# Altium schematic sheet [2] MCU.SchDoc
size A4; DocumentNumber: 3; SheetNumber: 3; SheetTotal: 4
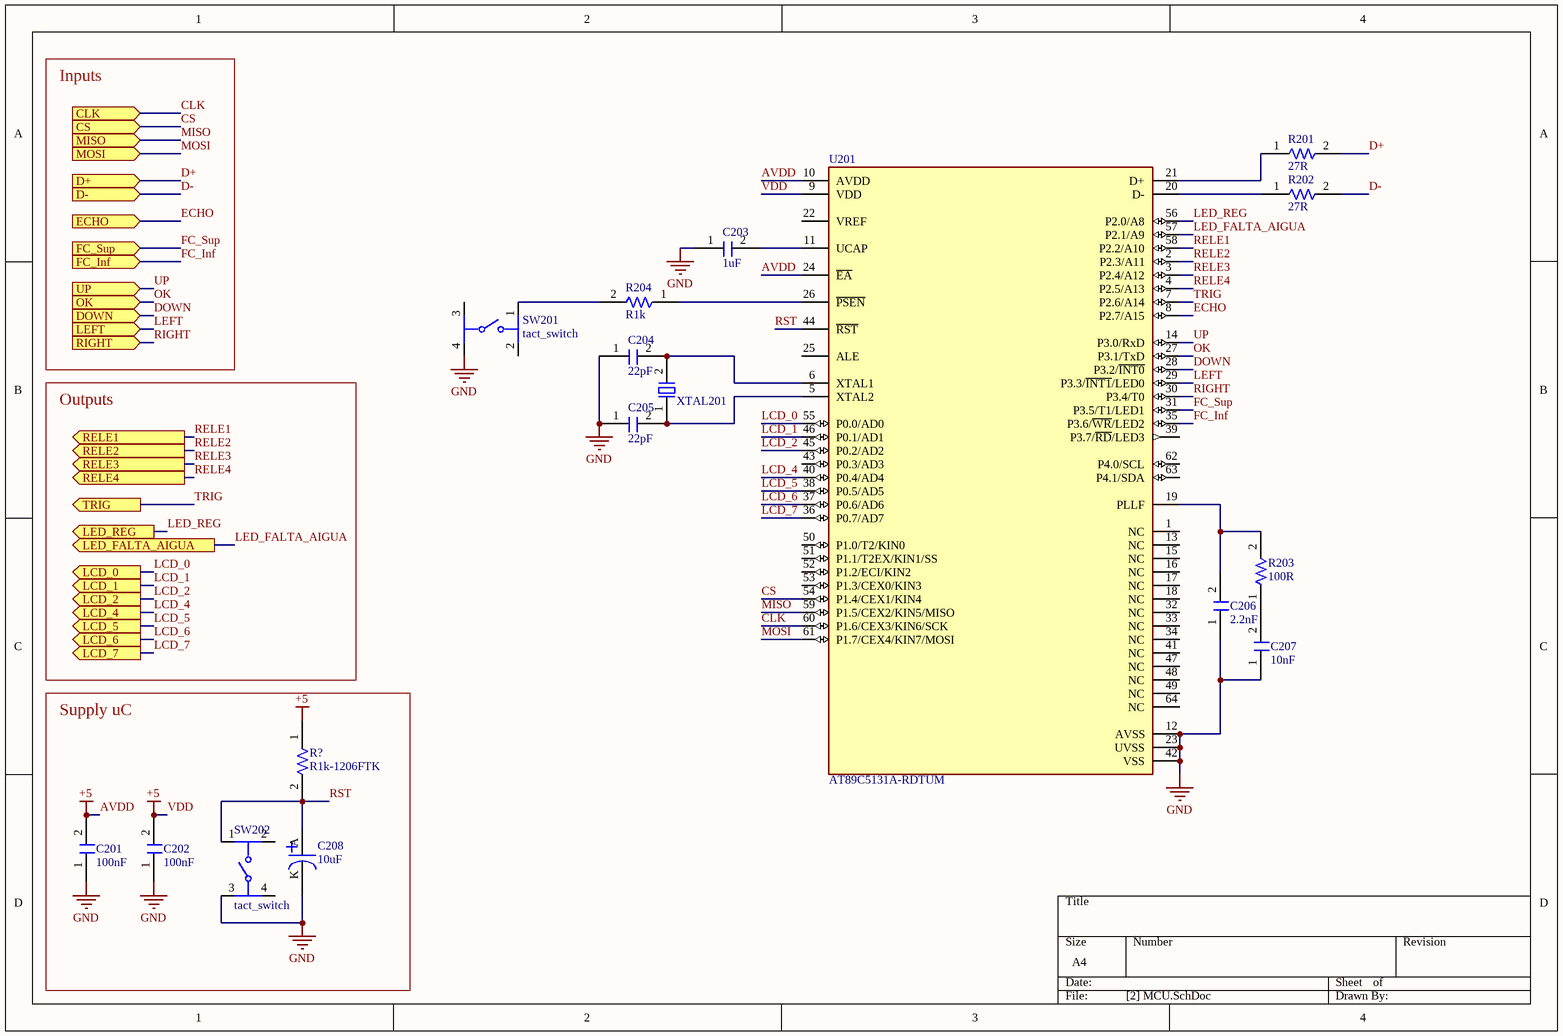
[diagram p0: [2] MCU.SchDoc]

## Parts
C201  Capacitance: 100nF  [C1206FNPC-RW]  (hidden comment: 885012208058)
C202  Capacitance: 100nF  [C1206FNPC-RW]  (hidden comment: 885012208058)
C203  Capacitance: 1uF  [C1206FNPC-RW]  (hidden comment: 885012208013)
C204  Capacitance: 22pF  [C0805FNPC-W]  (hidden comment: 885012208058)
C205  Capacitance: 22pF  [C0805FNPC-W]  (hidden comment: 885012208058)
C206  Capacitance: 2.2nF  [C2.2u-100V-1812MLCC-X7R]  (hidden comment: HMK432B7225KM-T)
C207  Capacitance: 10nF  [C0805FNPC-R]  (hidden comment: 885012207092)
C208  10uF  [C100u-100V-0.9A]
R201  Resistance: 27R  [R1206FTK-W]  (hidden comment: RCC1206470RFKEA)
R202  Resistance: 27R  [R1206FTK-W]  (hidden comment: RCC1206470RFKEA)
R203  Resistance: 100R  [R1206FTK-W]  (hidden comment: CRG1206F100R)
R204  R1k  [R1206FTK-W]
R?  R1k-1206FTK  [R1206FTK-W]
SW201  tact_switch  [FP-PTS647SK38SMTR2LFS-MFG]
SW202  tact_switch  [FP-PTS647SK38SMTR2LFS-MFG]
U201  AT89C5131A-RDTUM  [FP-AT89C5131A-RDTUM-IPC_C]
XTAL201  XTAL20M_SMD  [XTAL20M_SMD]  (value not drawn)

## Blocks framed on the sheet
Supply uC: C201 C202 C208 R? SW202

## Ports
CLK (in, see AD_info[2B], [3] ADC[1A]), CS (in, see AD_info[2B], [3] ADC[1A]), D+ (in, see AD_info[2B]), D- (in, see AD_info[2B]), DOWN (in, see AD_info[2C], [4] Ports[1B]), ECHO (in, see AD_info[2B]), FC_Inf (in, see AD_info[2B]), FC_Sup (in, see AD_info[2B]), LCD_0 (out, see AD_info[2B], [4] Ports[1A]), LCD_1 (out, see AD_info[2C], [4] Ports[1A]), LCD_2 (out, see AD_info[2C], [4] Ports[1B]), LCD_4 (out, see AD_info[2C], [4] Ports[1B]), LCD_5 (out, see AD_info[2C], [4] Ports[1B]), LCD_6 (out, see AD_info[2C], [4] Ports[1B]), LCD_7 (out, see AD_info[2C], [4] Ports[1B]), LED_FALTA_AIGUA (out, see AD_info[2B], [4] Ports[1A]), LED_REG (out, see AD_info[2B], [4] Ports[1A]), LEFT (in, see AD_info[2C], [4] Ports[1B]), MISO (in, see AD_info[2B], [3] ADC[1A]), MOSI (in, see AD_info[2B], [3] ADC[1B]), OK (in, see AD_info[2C], [4] Ports[1B]), RELE1 (out, see AD_info[2B], [4] Ports[1A]), RELE2 (out, see AD_info[2B]), RELE3 (out, see AD_info[2B]), RELE4 (out, see AD_info[2B]), RIGHT (in, see AD_info[2C], [4] Ports[1B]), TRIG (out, see AD_info[2B]), UP (in, see AD_info[2B], [4] Ports[1B])

## Nets
AVDD: C201.2 C202.2 R?.1 U201.9(VDD) U201.10(AVDD) U201.24(~{EA})  [also labelled +5, VDD]
GND: C201.1 C202.1 C203.1 C204.1 C205.1 C206.1 C207.1 C208.K(-) SW201.4 SW202.3 U201.12(AVSS) U201.23(UVSS) U201.42(VSS)
CLK: U201.60(P1.6/CEX3/KIN6/SCK) ; port CLK
CS: U201.54(P1.4/CEX1/KIN4) ; port CS
D+: R201.2 ; port D+
D-: R202.2 ; port D-
DOWN: U201.28(P3.2/~{INT0}) ; port DOWN
ECHO: U201.8(P2.7/A15) ; port ECHO
FC_Inf: U201.35(P3.6/~{WR}/LED2) ; port FC_Inf
FC_Sup: U201.31(P3.5/T1/LED1) ; port FC_Sup
LCD_0: U201.55(P0.0/AD0) ; port LCD_0
LCD_1: U201.46(P0.1/AD1) ; port LCD_1
LCD_2: U201.45(P0.2/AD2) ; port LCD_2
LCD_4: U201.40(P0.4/AD4) ; port LCD_4
LCD_5: U201.38(P0.5/AD5) ; port LCD_5
LCD_6: U201.37(P0.6/AD6) ; port LCD_6
LCD_7: U201.36(P0.7/AD7) ; port LCD_7
LED_FALTA_AIGUA: U201.57(P2.1/A9) ; port LED_FALTA_AIGUA
LED_REG: U201.56(P2.0/A8) ; port LED_REG
LEFT: U201.29(P3.3/~{INT1}/LED0) ; port LEFT
MISO: U201.59(P1.5/CEX2/KIN5/MISO) ; port MISO
MOSI: U201.61(P1.7/CEX4/KIN7/MOSI) ; port MOSI
OK: U201.27(P3.1/TxD) ; port OK
RELE1: U201.58(P2.2/A10) ; port RELE1
RELE2: U201.2(P2.3/A11) ; port RELE2
RELE3: U201.3(P2.4/A12) ; port RELE3
RELE4: U201.4(P2.5/A13) ; port RELE4
RIGHT: U201.30(P3.4/T0) ; port RIGHT
RST: C208.A(+) R?.2 SW202.1 U201.44(~{RST})
TRIG: U201.7(P2.6/A14) ; port TRIG
UP: U201.14(P3.0/RxD) ; port UP
NetC203_2: C203.2 U201.11(UCAP)
NetC204_2: C204.2 U201.6(XTAL1) XTAL201.2
NetC205_2: C205.2 U201.5(XTAL2) XTAL201.1
NetC206_2: C206.2 R203.2 U201.19(PLLF)
NetC207_2: C207.2 R203.1
NetR201_1: R201.1 U201.21(D+)
NetR202_1: R202.1 U201.20(D-)
NetR204_1: R204.1 U201.26(~{PSEN})
NetR204_2: R204.2 SW201.1

Not connected (* = marked no-connect by the designer): SW201 2 3; SW202 2 4; U201 1(NC) 13(NC) 15(NC) 16(NC) 17(NC) 18(NC) 22(VREF) 25(ALE) 32(NC) 33(NC) 34(NC) 39(P3.7/~{RD}/LED3) 41(NC) 43(P0.3/AD3) 47(NC) 48(NC) 49(NC) 50(P1.0/T2/KIN0) 51(P1.1/T2EX/KIN1/SS) 52(P1.2/ECI/KIN2) 53(P1.3/CEX0/KIN3) 62(P4.0/SCL) 63(P4.1/SDA) 64(NC)

## Notes on the sheet
- Inputs
- Outputs

## Library data of the parts
C201 C202 = C100n-25V-1206FNPC-X7R: Cap Cer 0.1UF 25V X7R 1206; Manufacturer: Wurth Electronics; Tolerance: 10%; .Creator: DO; Category: Capacitor; ComponentLink1Description: Datasheet; ComponentLink1URL: https://www.we-online.com/catalog/datasheet/885012208058.pdf; ComponentLink2Description: Where buy it; ComponentLink2URL: https://www.we-online.com/catalog/en/WCAP-CSGP-25VDC#885012208058; Supplier 1: Digi-Key; Manufacturer Part Number: 885012208058; RoHS: Yes; Stock 1: 4375; Pricing 1: 1=0,11000, 10=0,10100, 100=0,09100, 500=0,08000 (USD); Mount: Surface Mount; Case/Package: 1206; Case Code (Metric): 3216; Case Code (Imperial): 1206; Min Operating Temperature: -55°C; Max Operating Temperature: 125°C; Packaging: Tape and Reel; Voltage Rating: 25V; Length: 0.126inch; Width: 0.063inch; Thickness: 0.035inch; RoHS Compliant: Yes; ComponentLink3URL: https://katalog.we-online.de/pbs/datasheet/885012208058.pdf?src-supplier=Digi-Key; ComponentLink3Description: https://katalog.we-online.de/pbs/datasheet/885012208058.pdf?src-supplier=Digi-Key; Supplier Part Number 1: 732-8109-1-ND
C203 = C1u-10V-1206FNPC-X7R: Cap, Mlcc, X7R, 1Uf, 10V, 1206 Rohs Compliant: Yes; Manufacturer 1: Wurth Electronics; Tolerance: 10%; .Creator: GP; Supplier 1: Digi-Key; Manufacturer Part Number 1: 885012208013; RoHS: Yes; Category: Ceramic Capacitors; Stock 1: 2734; Pricing 1: 1=0,16000, 10=0,14900, 100=0,13300, 500=0,11800 (USD); Mount: Surface Mount; Case/Package: 1206; Case Code (Metric): 3216; Case Code (Imperial): 1206; Min Operating Temperature: -55°C; Max Operating Temperature: 125°C; Packaging: Tape and Reel; Voltage Rating: 10V; Length: 0.126inch; Width: 0.063inch; Thickness: 0.051inch; RoHS Compliant: Yes; ComponentLink1URL: https://katalog.we-online.de/pbs/datasheet/885012208013.pdf?src-supplier=Digi-Key; ComponentLink1Description: https://katalog.we-online.de/pbs/datasheet/885012208013.pdf?src-supplier=Digi-Key; Supplier Part Number 1: 732-7685-1-ND; ComponentLink2Description: Wurth Elektronik; ComponentLink2URL: https://www.we-online.com/catalog/en/WCAP-CSGP-10VDC?sq=885012208013#885012208013
C204 C205 = C0.22u-0805FNPC-X5R: Cap Ceramic 0.22uF 50V X5R 10% Pad SMD 0805 85C Low ESR Automotive T/R; Manufacturer: Taiyo Yuden; Manufacturer Part Number: UMK212BJ224KGHT; .Creator: DR; Category: Capacitor; ComponentLink1Description: Datasheet; ComponentLink1URL: https://eu.mouser.com/datasheet/2/396/taiyo_yuden_12132018_mlcc11_hq_e-1510082.pdf; ComponentLink2Description: Where buy it; ComponentLink2URL: https://eu.mouser.com/ProductDetail/Taiyo-Yuden/UMK212BJ224KGHT?qs=CNQs48zzdnpf%2FbZJTfp33Q%3D%3D; Supplier 1: Digi-Key; RoHS: Yes; Stock 1: 900; Pricing 1: 1=0,20000, 10=0,13700, 50=0,08220, 100=0,06950, 500=0,04754, 1000=0,04206 (USD); Mount: Surface Mount; Case/Package: 0805; Case Code (Metric): 2012; Case Code (Imperial): 0805; Min Operating Temperature: -55°C; Max Operating Temperature: 85°C; Package Quantity: 3000; Packaging: Tape and Reel; Tolerance: 10%; Voltage Rating: 50V; Voltage Rating (DC): 50V; Dielectric: X5R; Termination: SMD/SMT; Length: 0.079inch; Width: 0.049inch; Height: 1.25mm; Thickness: 0.053inch; Ratings: AEC-Q200; Lead Free: Lead Free; Halogen Free: Halogen Free; RoHS Compliant: Yes; Supplier Part Number 1: 587-3514-1-ND
C206 = C2.2u-100V-1812MLCC-X7R: 贴片陶瓷电容 2.2uF ±10% 100V X7R 1812; Manufacturer: Taiyo Yuden; .Creator: DO; Manufacturer Part Number: HMK432B7225KM-T; RoHS: Yes; Category: Ceramic Capacitors; Stock 1: 13000; Pricing 1: 500=0,58000, 1000=0,47500, 1500=0,47000, 2000=0,46500 (USD); Mount: Surface Mount; Case/Package: 1812; Number of Pins: 2; Case Code (Metric): 4532; Case Code (Imperial): 1812; Min Operating Temperature: -55°C; Max Operating Temperature: 125°C; Package Quantity: 1; Voltage Rating: 100V; Tolerance: 10%; Packaging: Tape and Reel; Voltage Rating (DC): 100V; Dielectric: X7R; Termination: SMD/SMT; Series: M; Construction: Flat; Resistor Type: Ceramic; Length: 4.5mm; Width: 0.126inch; Height: 2.5mm; Thickness: 0.106inch; Depth: 3.2mm; Radiation Hardening: No; RoHS Compliant: Yes; REACH SVHC: Unknown; Halogen Free: Halogen Free; ComponentLink1URL: https://datasheet.ciiva.com/142/hmk432b7225km-t-ss-142288.pdf?src-supplier=Digi-Key; ComponentLink1Description: https://datasheet.ciiva.com/142/hmk432b7225km-t-ss-142288.pdf?src-supplier=Digi-Key; ComponentLink2URL: https://datasheet.ciiva.com/26871/getdatasheetpartid-638888-26871989.pdf?src-supplier=Verical; ComponentLink2Description: https://datasheet.ciiva.com/26871/getdatasheetpartid-638888-26871989.pdf?src-supplier=Verical; ComponentLink3URL: https://datasheet.ciiva.com/30247/946hmk432b7225km-t-30247370.pdf?src-supplier=Onlinecomponents.com; ComponentLink3Description: https://datasheet.ciiva.com/30247/946hmk432b7225km-t-30247370.pdf?src-supplier=Onlinecomponents.com; ComponentLink4URL: https://datasheet.ciiva.com/28645/746258-28645086.pdf?src-supplier=Element14; ComponentLink4Description: https://datasheet.ciiva.com/28645/746258-28645086.pdf?src-supplier=Element14; ComponentLink5URL: https://datasheet.ciiva.com/15921/mlcc06-e-15921031.pdf?src-supplier=Onlinecomponents.com; ComponentLink5Description: https://datasheet.ciiva.com/15921/mlcc06-e-15921031.pdf?src-supplier=Onlinecomponents.com; Supplier Part Number 1: 9062137; Supplier 1: Future Electronics
C207 = C10n-50V-0805FNPC-X7R: Cap, 0.01ΜF, 50V, 10%, X7R, 0805; Manufacturer 1: Wurth Electronics; .Creator: DR; Supplier 1: RSComponents; Manufacturer Part Number 1: 885012207092; RoHS: Yes; Category: Ceramic Capacitors; Stock 1: 1; Pricing 1: 4000=0,03200, 12000=0,03100 (USD); Mount: Surface Mount; Case/Package: 0805; Case Code (Metric): 2012; Case Code (Imperial): 0805; Min Operating Temperature: -55°C; Max Operating Temperature: 125°C; Packaging: Cut Tape; Voltage Rating: 50V; Dielectric: X7R; Tolerance: 10%; Voltage Rating (DC): 50V; Length: 0.079inch; Width: 0.049inch; Thickness: 0.035inch; REACH SVHC: Unknown; RoHS Compliant: Yes; ComponentLink1URL: http://www.farnell.com/datasheets/1958497.pdf?src-supplier=Farnell; ComponentLink1Description: http://www.farnell.com/datasheets/1958497.pdf?src-supplier=Farnell; ComponentLink2URL: http://www.farnell.com/datasheets/1958497.pdf?src-supplier=Element14; ComponentLink2Description: http://www.farnell.com/datasheets/1958497.pdf?src-supplier=Element14; ComponentLink3URL: http://www.farnell.com/datasheets/1958497.pdf?src-supplier=Newark; ComponentLink3Description: http://www.farnell.com/datasheets/1958497.pdf?src-supplier=Newark; ComponentLink4URL: https://katalog.we-online.de/pbs/datasheet/885012207092.pdf?src-supplier=Digi-Key; ComponentLink4Description: https://katalog.we-online.de/pbs/datasheet/885012207092.pdf?src-supplier=Digi-Key; Supplier Part Number 1: 1813941
C208 = CMP-00044-1: Cap 100 Uf 20% 100 V; Manufacturer: Wurth Electronics; Manufacturer Part Number: 860130878011; Voltage Rating: 100V; Value: 100µF; Ripple Current: 270mA; Polarity: Polar; .Creator: GP; Life (Hours): 2000Hour; Lead Pitch: 0.197inch; Package Quantity: 300; Tolerance: 20%; Case/Package: Radial; Source: Passives.SchLib; ComponentLink1Description: http://katalog.we-online.de/pbs/datasheet/860130878011.pdf?src-supplier=Digi-Key; Max Operating Temperature: 125°C; Min Operating Temperature: -40°C; Pricing 1: 2=1,84300, 20=1,71500, 50=1,54700, 100=1,43900, 200=1,27100 (USD); Mount: Through Hole; Stock 1: 1; Packaging: Tape and Reel; ComponentLink1URL: http://katalog.we-online.de/pbs/datasheet/860130878011.pdf?src-supplier=Digi-Key; RoHS: Yes; Design Item ID: C100u-100V-0.9A; Height - Seated (Max): 1.043inch; RoHS Compliant: Yes; Category: Aluminum Electrolytic Capacitors
R201 R202 = R470-1206FTK: Res Thick Film 1206 470 Ohm 1% 1/2W ±100ppm/°C Molded SMD; Manufacturer: Vishay Dale; .Creator: AC; Supplier 1: Newark; RoHS: Yes; Stock 1: 3700; Pricing 1: 10=0,22000, 25=0,17500, 50=0,13000, 100=0,08600, 250=0,06900, 500=0,05200, 1000=0,03500 (USD); Supplier Part Number 1: 45AJ7205; Manufacturer Part Number: RCC1206470RFKEA; ComponentLink1Description: Where buy it; ComponentLink1URL: https://www.mouser.es/ProductDetail/Vishay-Dale/RCC1206470RFKEA?qs=sGAEpiMZZMvdGkrng054twq3eZrCFN897p18zMH0sI9ArskKyJc2dg%3D%3D; ComponentLink2Description: Datasheet; ComponentLink2URL: https://www.mouser.es/datasheet/2/427/rcce3-2897337.pdf
R203 = R100-1206FTK: Res Thick Film 1206 100 Ohm 1% 0.25W(1/4W) ±200ppm/C Pad SMD T/R; Manufacturer: TE Connectivity; Temperature Coefficient: 200ppm/°C; Max Power Dissipation: 250mW; Voltage Rating: 200V; Number of Resistors: 1; .Creator: AC; Category: Resistor; ComponentLink1Description: Datasheet; ComponentLink1URL: https://docs.rs-online.com/7aab/0900766b815b7339.pdf; ComponentLink2Description: Where buy it; ComponentLink2URL: https://es.rs-online.com/web/p/resistencias-de-montaje-en-superficie/2232120; Supplier 1: Digi-Key; Manufacturer Part Number: CRG1206F100R; RoHS: Yes; Stock 1: 13476; Pricing 1: 1=0,10000, 10=0,07600, 100=0,02920, 1000=0,01285, 2500=0,01110 (USD); Mount: Surface Mount; Case/Package: 1206; Case Code (Imperial): 1206; Case Code (Metric): 3216; Weight: 0.000571oz; Min Operating Temperature: -55°C; Max Operating Temperature: 125°C; Tolerance: 1%; Resistor Type: Thick Film; Packaging: Tape and Reel; Package Quantity: 5000; Number of Terminations: 2; Series: CRG, Neohm; Power Rating: 250mW; Termination: Solder; Technology: THICK FILM; Length: 3.1mm; Width: 1.55mm; Height: 0.55mm; Depth: 1.55mm; Radiation Hardening: No; RoHS Compliant: Yes; ELV: Compliant; ComponentLink3URL: https://datasheet.ciiva.com/11808/0900766b800a696e-11808648.pdf?src-supplier=RSComponents; ComponentLink3Description: https://datasheet.ciiva.com/11808/0900766b800a696e-11808648.pdf?src-supplier=RSComponents; ComponentLink4URL: https://datasheet.ciiva.com/16763/70063020-16763547.pdf?src-supplier=Allied+Electronics; ComponentLink4Description: https://datasheet.ciiva.com/16763/70063020-16763547.pdf?src-supplier=Allied+Electronics; ComponentLink5URL: https://datasheet.ciiva.com/5562/eng-ds-1773204-g-5562604.pdf?src-supplier=Mouser; ComponentLink5Description: https://datasheet.ciiva.com/5562/eng-ds-1773204-g-5562604.pdf?src-supplier=Mouser; Supplier Part Number 1: A106068CT-ND
R204 R? = CMP-00077-3: Res Thick Film 1206 1K Ohm 5% 0.33W(1/3W) ±200ppm/C Pad SMD Automotive T/R; Manufacturer Part Number: ERJT08J102V; Manufacturer: Panasonic; Voltage Rating: 200V; Temperature Coefficient: 200ppm/°C; .Creator: GP; Max Power Dissipation: 333mW; Power Rating: 330mW; Min Operating Temperature: -55°C; Radiation Hardening: No; Packaging: Tape and Reel; Tolerance: 5%; RoHS Compliant: Yes; Height: 0.6mm; Resistor Type: Thick Film; Features: Automotive AEC-Q200; Pricing 1: 5=0,32200, 50=0,30000, 100=0,28100, 250=0,25900, 500=0,23800 (USD); REACH SVHC: No SVHC; Width: 0.063inch; Source: Passives.SchLib; Case Code (Metric): 3216; Termination: Tab; Mount: Surface Mount; ComponentLink1URL: https://docs.rs-online.com/ef78/0900766b812cb812.pdf; ComponentLink1Description: Datasheet; Max Operating Temperature: 155°C; Contact Plating: Tin; Package Quantity: 5000; ComponentLink2URL: https://es.rs-online.com/web/p/resistencias-de-montaje-en-superficie/7218936; Military Standard: Not; RoHS: Yes; Category: Resistor; Stock 1: 1; Voltage Rating (DC): 200V; Value: 1k; Design Item ID: R1k-1206FTK; Depth: 1.6mm; Number of Terminations: 2; Case/Package: 1206; ComponentLink2Description: Where buy it; Pins: 2; Length: 3.2mm
SW201 SW202 = CMP-00028-00009-1: Keypad Switch, 1 Switches, SPST, Momentary-tactile, 0.05A, 12VDC, 2.94N, Solder Terminal, Surface Mount-straight; RoHS Compliant: Yes
U201 = AT89C5131A-RDTUM-1: Microcontroller, 8-Bit, FLASH, 8051 CPU, 48MHz, CMOS, PQFP64; Nominal Supply Voltage: 3.3V; Interface: SPI,USB,UART; Min Supply Voltage: 2.7V; Max Supply Voltage: 5.5V; Min Operating Temperature: -40°C; Max Operating Temperature: 85°C; Case/Package: LFQFP; Pins: 64; RoHS Compliant: Yes; Clock Frequency: 48MHz
XTAL201 = CMP-00109-1: 830028710, 20 MHz; Manufacturer: Würth Elektronik; Frequency: 20MHz; Drive level: 500µW max; .Creator: GP; Frequency Stability: +-50 ppm; Max power dissipation: *; Number of pins: 2; Min Operating Temperature: -40ºC; Packaging: Reel; Manufacturer Part Number: 830028710; Max operating temperature.: 85ºC; RoHS: Yes; Source: Passives.SchLib; Stock 1: 975; ComponentLink1Description: Datasheet; Pricing 1: 1=0,37000, 10=0,28100, 50=0,26800, 100=0,24400, 500=0,22000 (USD); Type: SMD; Category: XTAL; ComponentLink1URL: https://www.we-online.com/catalog/datasheet/830028710.pdf; Design Item ID: XTAL20M_SMD; Package: *; Power Rating: *